# Altium schematic sheet 5_rf_path.SchDoc: RF path and LoRa transceiver
size A4; OrganizationName: Pluton UPV; Address1: Universitat Politècnica; Address2: de València (UPV); Address3: Camí de Vera, València; Address4: Spain; SheetNumber: 6; SheetTotal: 12
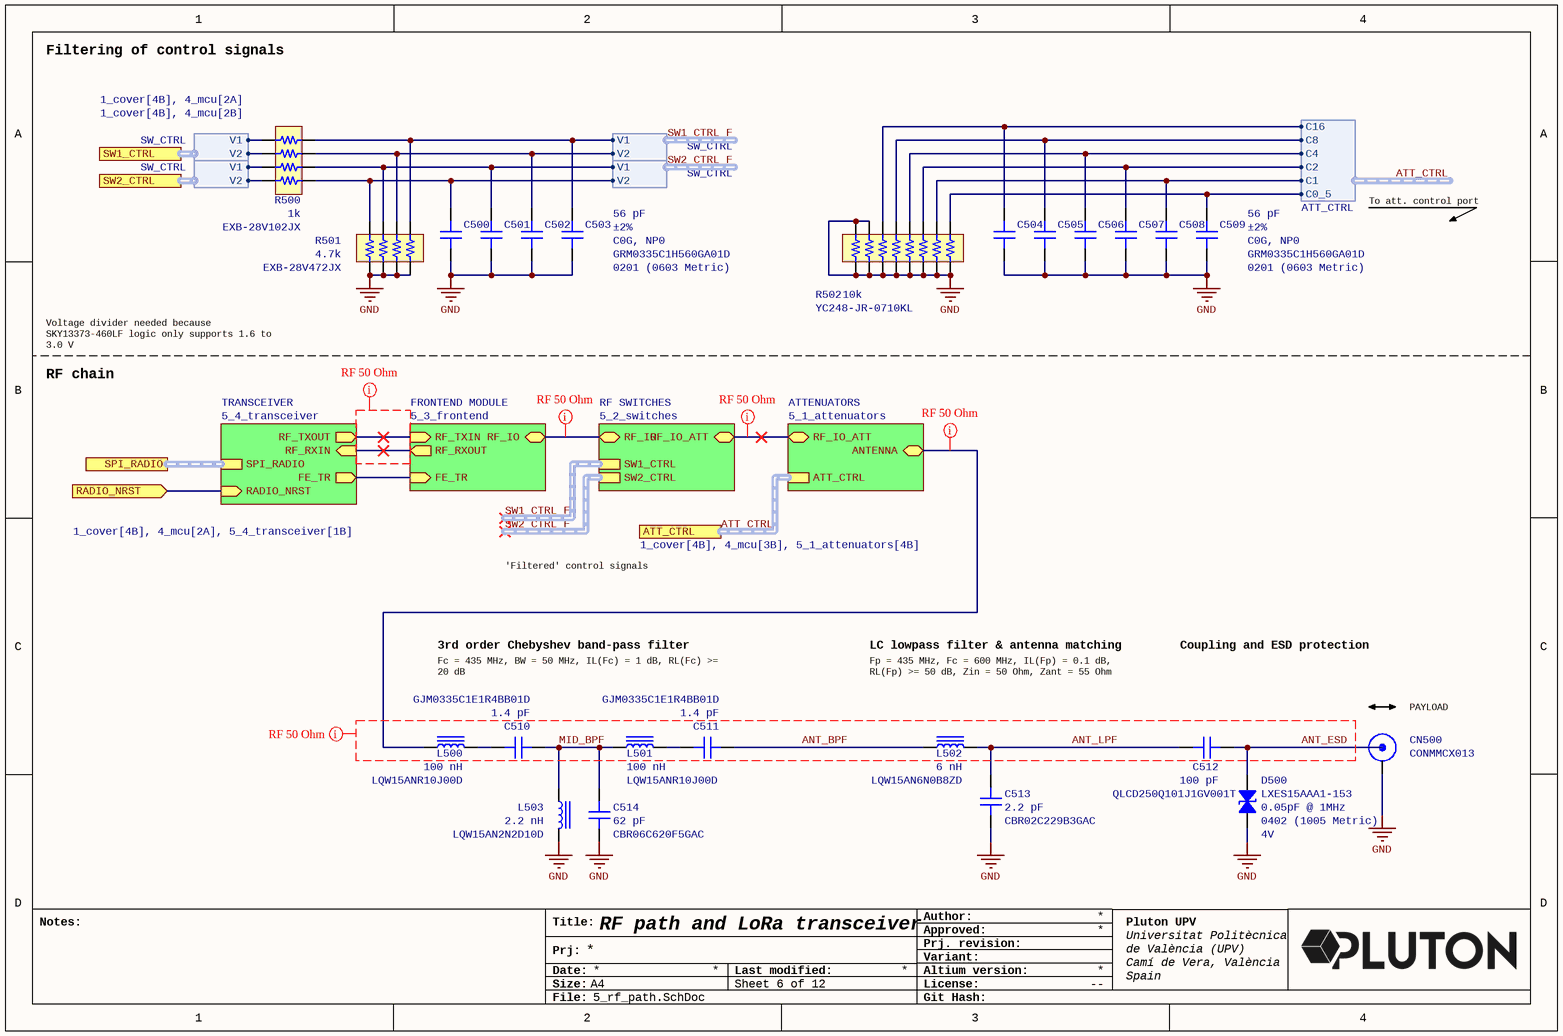
[diagram p0: 5_rf_path.SchDoc]

## Parts
C500  56 pF  [CAP 0201_0603]  (value not drawn)
C501  56 pF  [CAP 0201_0603]  (value not drawn)
C502  56 pF  [CAP 0201_0603]  (value not drawn)
C503  Part Number: GRM0335C1H560GA01D  Package / Case: 0201 (0603 Metric)  Temperature Coefficient: C0G, NP0  Tolerance: ±2%  [CAP 0201_0603]  (hidden comment: 56 pF)
C504  56 pF  [CAP 0201_0603]  (value not drawn)
C505  56 pF  [CAP 0201_0603]  (value not drawn)
C506  56 pF  [CAP 0201_0603]  (value not drawn)
C507  56 pF  [CAP 0201_0603]  (value not drawn)
C508  56 pF  [CAP 0201_0603]  (value not drawn)
C509  Part Number: GRM0335C1H560GA01D  Package / Case: 0201 (0603 Metric)  Temperature Coefficient: C0G, NP0  Tolerance: ±2%  [CAP 0201_0603]  (hidden comment: 56 pF)
C510  Part Number: GJM0335C1E1R4BB01D  [CAP 0201_0603 RF]  (hidden comment: 1.4 pF)
C511  Part Number: GJM0335C1E1R4BB01D  [CAP 0201_0603 RF]  (hidden comment: 1.4 pF)
C512  Part Number: QLCD250Q101J1GV001T  [CAP 0201_0603 RF]  (hidden comment: 100 pF)
C513  Part Number: CBR02C229B3GAC  [CAP 0201_0603 RF]  (hidden comment: 2.2 pF)
C514  Part Number: CBR06C620F5GAC  [CAP 0603_1608 RF]  (hidden comment: 62 pF)
CN500  CONMMCX013  [CONMMCX013]
D500  Capacitance @ Frequency: 0.05pF @ 1MHz  Device Package: 0402 (1005 Metric)  Voltage - Reverse Standoff (Typ): 4V  [0402]  (hidden comment: LXES15AAA1-153)
L500  Part Number: LQW15ANR10J00D  [IND 0402_1005 RF WW]  (hidden comment: 100 nH)
L501  Part Number: LQW15ANR10J00D  [IND 0402_1005 RF WW]  (hidden comment: 100 nH)
L502  Part Number: LQW15AN6N0B8ZD  [IND 0402_1005 RF WW]  (hidden comment: 6 nH)
L503  Part Number: LQW15AN2N2D10D  [IND 0402_1005 RF WW]  (hidden comment: 2.2 nH)
R500  Resistance (Ohms): 1k  [RESNET 0804-8 CONVEX]  (hidden comment: EXB-28V102JX)
R501  Resistance (Ohms): 4.7k  [RESNET 0804-8 CONVEX]  (hidden comment: EXB-28V472JX)
R502  Resistance (Ohms): 10k  [RESNET 1606-16 CONVEX]  (hidden comment: YC248-JR-0710KL)

## Sub-sheets
ATTENUATORS = 5_1_attenuators: RF_IO_ATT (bidir), ANTENNA (bidir), ATT_CTRL (harness ATT_CTRL)
FRONTEND MODULE = 5_3_frontend: RF_TXIN (in), RF_RXOUT (out), RF_IO (bidir), FE_TR (in)
RF SWITCHES = 5_2_switches: RF_IO_ATT (bidir), RF_IO (bidir), SW1_CTRL (harness SW_CTRL), SW2_CTRL (harness SW_CTRL)
TRANSCEIVER = 5_4_transceiver: RF_TXOUT (out), RF_RXIN (in), FE_TR (out), SPI_RADIO (harness SPI), RADIO_NRST (in)

## Ports
ATT_CTRL (harness ATT_CTRL, see 1_cover[4B], 4_mcu[3B], 5_1_attenuators[4B]), RADIO_NRST (in, see 1_cover[4B], 4_mcu[2A], 5_4_transceiver[1B]), SPI_RADIO (harness SPI, see 1_cover[4B], 5_4_transceiver[1B]), SW1_CTRL (harness SW_CTRL, see 1_cover[4B], 4_mcu[2A]), SW2_CTRL (harness SW_CTRL, see 1_cover[4B], 4_mcu[2B])

## Harnesses
SW_CTRL: V1, V2
ATT_CTRL: C16, C8, C4, C2, C1, C0_5

## Nets
GND: C500.1 C501.1 C502.1 C503.1 C504.1 C505.1 C506.1 C507.1 C508.1 C509.1 C513.1 C514.1 CN500.2(GND) D500.1 L503.2 R501.5 R501.6 R501.7 R501.8 R502.1 R502.2 R502.3 R502.4 R502.5 R502.6 R502.7 R502.8 R502.15 R502.16
ANT_BPF: C511.2 L502.1
ANT_ESD: C512.2 CN500.1(SIGNAL) D500.2
ANT_LPF: C512.1 C513.2 L502.2
ATT_CTRL.C0_5: C509.2 R502.9 ; port ATT_CTRL.C0_5
ATT_CTRL.C1: C508.2 R502.10 ; port ATT_CTRL.C1
ATT_CTRL.C2: C507.2 R502.11 ; port ATT_CTRL.C2
ATT_CTRL.C4: C506.2 R502.12 ; port ATT_CTRL.C4
ATT_CTRL.C8: C505.2 R502.13 ; port ATT_CTRL.C8
ATT_CTRL.C16: C504.2 R502.14 ; port ATT_CTRL.C16
MID_BPF: C510.2 C514.2 L501.1 L503.1
RADIO_NRST: port RADIO_NRST, sheet TRANSCEIVER/RADIO_NRST
SW1_CTRL_F.V1: C503.2 R500.8 R501.1 ; sheet RF SWITCHES/SW1_CTRL.V1
SW1_CTRL_F.V2: C502.2 R500.7 R501.2 ; sheet RF SWITCHES/SW1_CTRL.V2
SW2_CTRL_F.V1: C501.2 R500.6 R501.3 ; sheet RF SWITCHES/SW2_CTRL.V1
SW2_CTRL_F.V2: C500.2 R500.5 R501.4 ; sheet RF SWITCHES/SW2_CTRL.V2
NetC510_1: C510.1 L500.2
NetC511_1: C511.1 L501.2
NetL500_1: L500.1 ; sheet ATTENUATORS/ANTENNA
NetR500_1: R500.1 ; port SW1_CTRL.V1
NetR500_2: R500.2 ; port SW1_CTRL.V2
NetR500_3: R500.3 ; port SW2_CTRL.V1
NetR500_4: R500.4 ; port SW2_CTRL.V2
(unnamed): sheet RF SWITCHES/RF_IO_ATT, sheet ATTENUATORS/RF_IO_ATT
(unnamed): sheet RF SWITCHES/RF_IO, sheet FRONTEND MODULE/RF_IO
(unnamed): sheet FRONTEND MODULE/RF_TXIN, sheet TRANSCEIVER/RF_TXOUT
(unnamed): sheet FRONTEND MODULE/RF_RXOUT, sheet TRANSCEIVER/RF_RXIN
(unnamed): sheet FRONTEND MODULE/FE_TR, sheet TRANSCEIVER/FE_TR

## Buses and harness runs
harness ATT_CTRL = port ATT_CTRL = sheet ATTENUATORS/ATT_CTRL
harness port SPI_RADIO = sheet TRANSCEIVER/SPI_RADIO
harness SW1_CTRL_F = sheet RF SWITCHES/SW1_CTRL
harness SW2_CTRL_F = sheet RF SWITCHES/SW2_CTRL

## Layout directives
net class RF50; rule Width Constraint [Pref Impedance = 50.00ohms    Min Impedance = 50.00ohms    Max Impedance = 50.00ohms]: (no net found under the mark), ANT_BPF, ANT_ESD, ANT_LPF, MID_BPF, NetL500_1

## Notes on the sheet
- Filtering of control signals
- To att. control port
- Voltage divider needed because SKY13373-460LF logic only supports 1.6 to 3.0 V
- RF chain
- 'Filtered' control signals
- 3rd order Chebyshev band-pass filter
- LC lowpass filter & antenna matching
- Coupling and ESD protection
- Fc = 435 MHz, BW = 50 MHz, IL(Fc) = 1 dB, RL(Fc) >= 20 dB
  Za = Zb = 50 Ohm
- Fp = 435 MHz, Fc = 600 MHz, IL(Fp) = 0.1 dB,
  RL(Fp) >= 50 dB, Zin = 50 Ohm, Zant = 55 Ohm
- (near CN500) PAYLOAD
- Notes:
- Title:
- Author:
- Approved:
- Date:
- Prj:
- Size:
- A4
- Last modified:
- Altium version:
- Variant:
- Prj. revision:
- License:
- --
- File:
- Git Hash:

## Library data of the parts
C500-C502 C504-C508 = GRM0335C1H560GA01D: CAP CER 56PF 50V C0G/NP0 0201; manufacturer: Murata Electronics; Temperature Coefficient: C0G, NP0; Tolerance: ±2%; Part Number: GRM0335C1H560GA01D; Value: 56 pF; Applications: General Purpose; Capacitance: 56 pF; componentlink1description: Datasheet; componentlink1url: https://search.murata.co.jp/Ceramy/image/img/A01X/G101/ENG/GRM0335C1H560GA01-01.pdf; componentlink2description: DigiKey Link; componentlink2url: https://www.digikey.com/en/products/detail/murata-electronics/GRM0335C1H560GA01D/4358755; Device Package: 0201 (0603 Metric); lastupdated: 04/06/2024 19:01:09; Lifecycle Status: Active; Minimum Order: 1; Mounting Type: Surface Mount; Operating Temperature: -55°C ~ 125°C; Package / Case: 0201 (0603 Metric); packaging: CutTape; partid: 528; Part Status: Active; price: 0.01; series: GRM; Size / Dimension: 0.024" L x 0.012" W (0.60mm x 0.30mm); Supplier 1: DigiKey; Supplier Part Number 1: 490-13329-1-ND; Thickness (Max): 0.013" (0.33mm); Voltage - Rated: 50V
C503 C509 = GRM0335C1H560GA01D: CAP CER 56PF 50V C0G/NP0 0201; manufacturer: Murata Electronics; Value: 56 pF; Applications: General Purpose; Capacitance: 56 pF; componentlink1description: Datasheet; componentlink1url: https://search.murata.co.jp/Ceramy/image/img/A01X/G101/ENG/GRM0335C1H560GA01-01.pdf; componentlink2description: DigiKey Link; componentlink2url: https://www.digikey.com/en/products/detail/murata-electronics/GRM0335C1H560GA01D/4358755; Device Package: 0201 (0603 Metric); lastupdated: 04/06/2024 19:01:09; Lifecycle Status: Active; Minimum Order: 1; Mounting Type: Surface Mount; Operating Temperature: -55°C ~ 125°C; packaging: CutTape; partid: 528; Part Status: Active; price: 0.01; series: GRM; Size / Dimension: 0.024" L x 0.012" W (0.60mm x 0.30mm); Supplier 1: DigiKey; Supplier Part Number 1: 490-13329-1-ND; Thickness (Max): 0.013" (0.33mm); Voltage - Rated: 50V
C510 C511 = GJM0335C1E1R4BB01D: CAP CER 1.4PF 25V C0G/NP0 0201; manufacturer: Murata Electronics; Temperature Coefficient: C0G, NP0; Tolerance: ±0.1pF; Applications: RF, Microwave, High Frequency; Capacitance: 1.4 pF; componentlink1description: Datasheet; componentlink1url: https://search.murata.co.jp/Ceramy/image/img/A01X/G101/ENG/GJM0335C1E1R4BB01-01.pdf; componentlink2description: DigiKey Link; componentlink2url: https://www.digikey.com/en/products/detail/murata-electronics/GJM0335C1E1R4BB01D/2592522; Device Package: 0201 (0603 Metric); Features: High Q, Low Loss; lastupdated: 03/06/2024 19:34:09; Lifecycle Status: Active; Minimum Order: 1; Mounting Type: Surface Mount; Operating Temperature: -55°C ~ 125°C; Package / Case: 0201 (0603 Metric); packaging: TapeAndReel; partid: 255; Part Status: Active; price: 0.01; series: GJM; Size / Dimension: 0.024" L x 0.012" W (0.60mm x 0.30mm); Supplier 1: DigiKey; Supplier Part Number 1: 490-11174-1-ND; Thickness (Max): 0.013" (0.33mm); value: 1.4 pF; Voltage - Rated: 25V
C512 = QLCD250Q101J1GV001T: CAP CER 100PF 25V C0G/NP0 0201; manufacturer: Johanson Technology Inc.; Temperature Coefficient: C0G, NP0; Tolerance: ±5%; Applications: RF, Microwave, High Frequency; Capacitance: 100 pF; componentlink1description: Datasheet; componentlink1url: https://www.johansontechnology.com/downloads/catalog/johanson-technology-multi-layer-high-q-capacitors.pdf; componentlink2description: DigiKey Link; componentlink2url: https://www.digikey.com/en/products/detail/johanson-technology-inc/QLCD250Q101J1GV001T/1561511; Device Package: 0201 (0603 Metric); Features: High Q, Low Loss; lastupdated: 03/06/2024 19:34:07; Lifecycle Status: Active; Minimum Order: 1; Mounting Type: Surface Mount, MLCC; Operating Temperature: -55°C ~ 125°C; Package / Case: 0201 (0603 Metric); packaging: TapeAndReel; partid: 3724; Part Status: Active; price: 0.02; series: L; Size / Dimension: 0.024" L x 0.012" W (0.60mm x 0.30mm); Supplier 1: DigiKey; Supplier Part Number 1: 712-QLCD250Q101J1GV001TCT-ND; Thickness (Max): 0.013" (0.33mm); value: 100 pF; Voltage - Rated: 25V
C513 = CBR02C229B3GAC: CAP CER 2.2PF 25V C0G/NP0 0201; manufacturer: KEMET; Temperature Coefficient: C0G, NP0; Tolerance: ±0.1pF; Applications: RF, Microwave, High Frequency; Capacitance: 2.2 pF; componentlink1description: Datasheet; componentlink1url: https://api.kemet.com/component-edge/download/datasheet/CBR02C229B3GAC.pdf; componentlink2description: DigiKey Link; componentlink2url: https://www.digikey.com/en/products/detail/kemet/CBR02C229B3GAC/3479233; Device Package: 0201 (0603 Metric); Features: High Q, Low Loss, Ultra Low ESR; lastupdated: 03/06/2024 19:34:10; Lifecycle Status: Active; Minimum Order: 1; Mounting Type: Surface Mount, MLCC; Operating Temperature: -55°C ~ 125°C; Package / Case: 0201 (0603 Metric); packaging: TapeAndReel; partid: 161; Part Status: Active; price: 0.02; series: CBR-SMD RF C0G; Size / Dimension: 0.024" L x 0.012" W (0.60mm x 0.30mm); Supplier 1: DigiKey; Supplier Part Number 1: 399-8607-1-ND; Thickness (Max): 0.013" (0.33mm); value: 2.2 pF; Voltage - Rated: 25V
C514 = CBR06C620F5GAC: CAP CER 62PF 50V C0G/NP0 0603; manufacturer: KEMET; Temperature Coefficient: C0G, NP0; Tolerance: ±1%; Applications: RF, Microwave, High Frequency; Capacitance: 62 pF; componentlink1description: Datasheet; componentlink1url: https://api.kemet.com/component-edge/download/datasheet/CBR06C620F5GAC.pdf; componentlink2description: DigiKey Link; componentlink2url: https://www.digikey.com/en/products/detail/kemet/CBR06C620F5GAC/7649525; Device Package: 0603 (1608 Metric); Features: High Q, Low Loss, Ultra Low ESR; lastupdated: 03/06/2024 19:44:09; Lifecycle Status: Active; Minimum Order: 1; Mounting Type: Surface Mount, MLCC; Operating Temperature: -55°C ~ 125°C; Package / Case: 0603 (1608 Metric); packaging: TapeAndReel; partid: 3653; Part Status: Active; price: 0.30; series: CBR-SMD RF C0G; Size / Dimension: 0.063" L x 0.031" W (1.60mm x 0.80mm); Supplier 1: DigiKey; Supplier Part Number 1: 399-16219-1-ND; Thickness (Max): 0.035" (0.90mm); value: 62 pF; Voltage - Rated: 50V
CN500 = MMCX-CONMMCX013: MMCX Jack PCB Cutout Edge Mount Connector 0 to 8.5 GHz operation MMCX (female socket) connection
D500 = LXES15AAA1-153: TVS DIODE 4V 1005; Manufacturer: Murata Electronics; Bidirectional Channels: 1; Power Line Protection: No; Type: Zener; Part Number: LXES15AAA1-153; Applications: General Purpose; ComponentLink1Description: Datasheet; ComponentLink1URL: https://www.murata.com/en-us/products/productdata/8796832759838/CRESD-E.pdf; ComponentLink2Description: DigiKey Link; ComponentLink2URL: http://digikey.com/product-detail/en/murata-electronics/LXES15AAA1-153/490-13210-2-ND/5843762; LastUpdated: 03/06/2024 20:23:00; Lifecycle Status: Active; Minimum Order: 0; Mounting Type: Surface Mount; Operating Temperature: -40°C ~ 85°C (TA); Package / Case: 0402 (1005 Metric); Packaging: TapeAndReel; PartId: 10448; Part Status: Active; Price: 0.04; Series: -; Supplier 1: DigiKey; Supplier Part Number 1: 490-13210-2-ND; Supplier Device Package: 1005
L500 L501 = LQW15ANR10J00D: FIXED IND 100NH 120MA 2.52OHM SM; Manufacturer: Murata Electronics; DC Resistance (DCR): 2.52Ohm Max; Frequency - Self Resonant: 1.5GHz; Inductance Frequency - Test: 100 MHz; Material - Core: Non-Magnetic; Q @ Freq: 20 @ 150MHz; Shielding: Unshielded; Tolerance: ±5%; Type: Drum Core, Wirewound; ComponentLink1Description: Datasheet; ComponentLink1URL: https://search.murata.co.jp/Ceramy/image/img/P02/JELF243A-0050.pdf; ComponentLink2Description: DigiKey Link; ComponentLink2URL: https://www.digikey.com/en/products/detail/murata-electronics/LQW15ANR10J00D/1016249; Current Rating (Amps): 120 mA; Device Package: 0402 (1005 Metric); Height - Seated (Max): 0.024" (0.60mm); Inductance: 100 nH; LastUpdated: 03/06/2024 20:03:22; Lifecycle Status: Active; Minimum Order: 1; Mounting Type: Surface Mount; Operating Temperature: -55°C ~ 125°C; Package / Case: 0402 (1005 Metric); Packaging: TapeAndReel; PartId: 282; Part Status: Active; Price: 0.04; Series: LQW15; Size / Dimension: 0.039" L x 0.020" W (1.00mm x 0.50mm); Supplier 1: DigiKey; Supplier Part Number 1: 490-4090-1-ND; Value: 100 nH
L502 = LQW15AN6N0B8ZD: FIXED IND 6NH 1.6A 0.056OHM SMD; Manufacturer: Murata Electronics; DC Resistance (DCR): 56mOhm Max; Frequency - Self Resonant: 8GHz; Inductance Frequency - Test: 100 MHz; Material - Core: Non-Magnetic; Q @ Freq: 32 @ 250MHz; Shielding: Unshielded; Tolerance: ±0.1nH; Type: Drum Core, Wirewound; ComponentLink1Description: Datasheet; ComponentLink1URL: https://search.murata.co.jp/Ceramy/image/img/P02/JELF243A-9138.pdf; ComponentLink2Description: DigiKey Link; ComponentLink2URL: https://www.digikey.com/en/products/detail/murata-electronics/LQW15AN6N0B8ZD/6798964; Current Rating (Amps): 1.6 A; Device Package: 0402 (1005 Metric); Height - Seated (Max): 0.024" (0.60mm); Inductance: 6 nH; LastUpdated: 03/06/2024 20:03:25; Lifecycle Status: Active; Minimum Order: 1; Mounting Type: Surface Mount; Operating Temperature: -55°C ~ 125°C; Package / Case: 0402 (1005 Metric); Packaging: TapeAndReel; PartId: 40; Part Status: Active; Price: 0.07; Ratings: AEC-Q200; Series: LQW15; Size / Dimension: 0.039" L x 0.024" W (1.00mm x 0.60mm); Supplier 1: DigiKey; Supplier Part Number 1: 490-15539-1-ND; Value: 6 nH
L503 = LQW15AN2N2D10D: FIXED IND 2.2NH 1A 0.027OHM SMD; Manufacturer: Murata Electronics; DC Resistance (DCR): 27mOhm Max; Frequency - Self Resonant: 14GHz; Inductance Frequency - Test: 100 MHz; Material - Core: Non-Magnetic; Q @ Freq: 25 @ 250MHz; Shielding: Unshielded; Tolerance: ±0.5nH; Type: Drum Core, Wirewound; ComponentLink1Description: Datasheet; ComponentLink1URL: https://search.murata.co.jp/Ceramy/image/img/P02/JELF243A-0051.pdf; ComponentLink2Description: DigiKey Link; ComponentLink2URL: https://www.digikey.com/en/products/detail/murata-electronics/LQW15AN2N2D10D/2594881; Current Rating (Amps): 1 A; Device Package: 0402 (1005 Metric); Height - Seated (Max): 0.024" (0.60mm); Inductance: 2.2 nH; LastUpdated: 03/06/2024 20:03:23; Lifecycle Status: Active; Minimum Order: 1; Mounting Type: Surface Mount; Operating Temperature: -55°C ~ 125°C; Package / Case: 0402 (1005 Metric); Packaging: TapeAndReel; PartId: 170; Part Status: Active; Price: 0.05; Series: LQW15; Size / Dimension: 0.039" L x 0.024" W (1.00mm x 0.60mm); Supplier 1: DigiKey; Supplier Part Number 1: 490-6795-1-ND; Value: 2.2 nH
R500 = EXB-28V102JX: RES ARRAY 4 RES 1K OHM 0804; Manufacturer: Panasonic Electronic Components; Circuit Type: Isolated; Number of Resistors: 4; Power Per Element: 62.5mW; Temperature Coefficient: ±200ppm/°C; Tolerance: ±5%; Part Number: EXB-28V102JX; Applications: Automotive AEC-Q200; ComponentLink1Description: Datasheet; ComponentLink1URL: https://industrial.panasonic.com/cdbs/www-data/pdf/AOC0000/AOC0000C14.pdf; ComponentLink2Description: DigiKey Link; ComponentLink2URL: https://www.digikey.com/en/products/detail/panasonic-electronic-components/EXB-28V102JX/256287; Height - Seated (Max): 0.018" (0.45mm); LastUpdated: 03/06/2024 20:05:56; Lifecycle Status: Active; Minimum Order: 1; Mounting Type: Surface Mount; Number of Pins: 8; Operating Temperature: -55°C ~ 125°C; Package / Case: 0804, Convex, Long Side Terminals; Packaging: TapeAndReel; PartId: 492; Part Status: Active; Price: 0.01; Series: EXB; Size / Dimension: 0.079" L x 0.039" W (2.00mm x 1.00mm); Supplier 1: DigiKey; Supplier Part Number 1: Y7102CT-ND; Supplier Device Package: 0804
R501 = EXB-28V472JX: RES ARRAY 4 RES 4.7K OHM 0804; Manufacturer: Panasonic Electronic Components; Circuit Type: Isolated; Number of Resistors: 4; Power Per Element: 62.5mW; Temperature Coefficient: ±200ppm/°C; Tolerance: ±5%; Part Number: EXB-28V472JX; Applications: Automotive AEC-Q200; ComponentLink1Description: Datasheet; ComponentLink1URL: https://industrial.panasonic.com/cdbs/www-data/pdf/AOC0000/AOC0000C14.pdf; ComponentLink2Description: DigiKey Link; ComponentLink2URL: https://www.digikey.com/en/products/detail/panasonic-electronic-components/EXB-28V472JX/256295; Height - Seated (Max): 0.018" (0.45mm); LastUpdated: 03/06/2024 20:05:56; Lifecycle Status: Active; Minimum Order: 1; Mounting Type: Surface Mount; Number of Pins: 8; Operating Temperature: -55°C ~ 125°C; Package / Case: 0804, Convex, Long Side Terminals; Packaging: TapeAndReel; PartId: 462; Part Status: Active; Price: 0.01; Series: EXB; Size / Dimension: 0.079" L x 0.039" W (2.00mm x 1.00mm); Supplier 1: DigiKey; Supplier Part Number 1: Y7472CT-ND; Supplier Device Package: 0804
R502 = YC248-JR-0710KL: RES ARRAY 8 RES 10K OHM 1606; Manufacturer: Yageo; Circuit Type: Isolated; Number of Resistors: 8; Power Per Element: 62.5mW; Temperature Coefficient: ±200ppm/°C; Tolerance: ±5%; Part Number: YC248-JR-0710KL; Applications: DDRAM, SDRAM; ComponentLink1Description: Datasheet; ComponentLink1URL: https://www.yageo.com/upload/media/product/productsearch/datasheet/rchip/PYu-YC_TC_group_51_RoHS_L_9.pdf; ComponentLink2Description: DigiKey Link; ComponentLink2URL: https://www.digikey.com/en/products/detail/yageo/YC248-JR-0710KL/1005237; Height - Seated (Max): 0.022" (0.55mm); LastUpdated: 03/06/2024 20:04:14; Lifecycle Status: Active; Minimum Order: 1; Mounting Type: Surface Mount; Number of Pins: 16; Operating Temperature: -55°C ~ 155°C; Package / Case: 1606, Convex, Long Side Terminals; Packaging: TapeAndReel; PartId: 10; Part Status: Active; Price: 0.03; Series: YC248; Size / Dimension: 0.157" L x 0.063" W (4.00mm x 1.60mm); Supplier 1: DigiKey; Supplier Part Number 1: 13-YC248-JR-0710KLDKR-ND